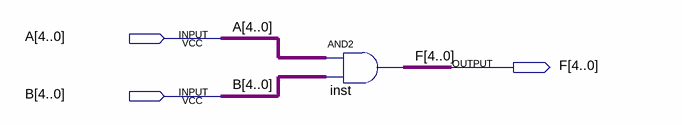
[diagram p0: schematic sheet]
// Quartus schematic porta_and.bdf as structural Verilog: 1 symbols, 3 pins
module porta_and (
  input  [4:0] A,
  input  [4:0] B,
  output [4:0] F
);

  assign F = A & B;  // AND2 inst, 5 bits wide
endmodule
